# EAGLE design MegaMini (EAGLE 8.3.2)
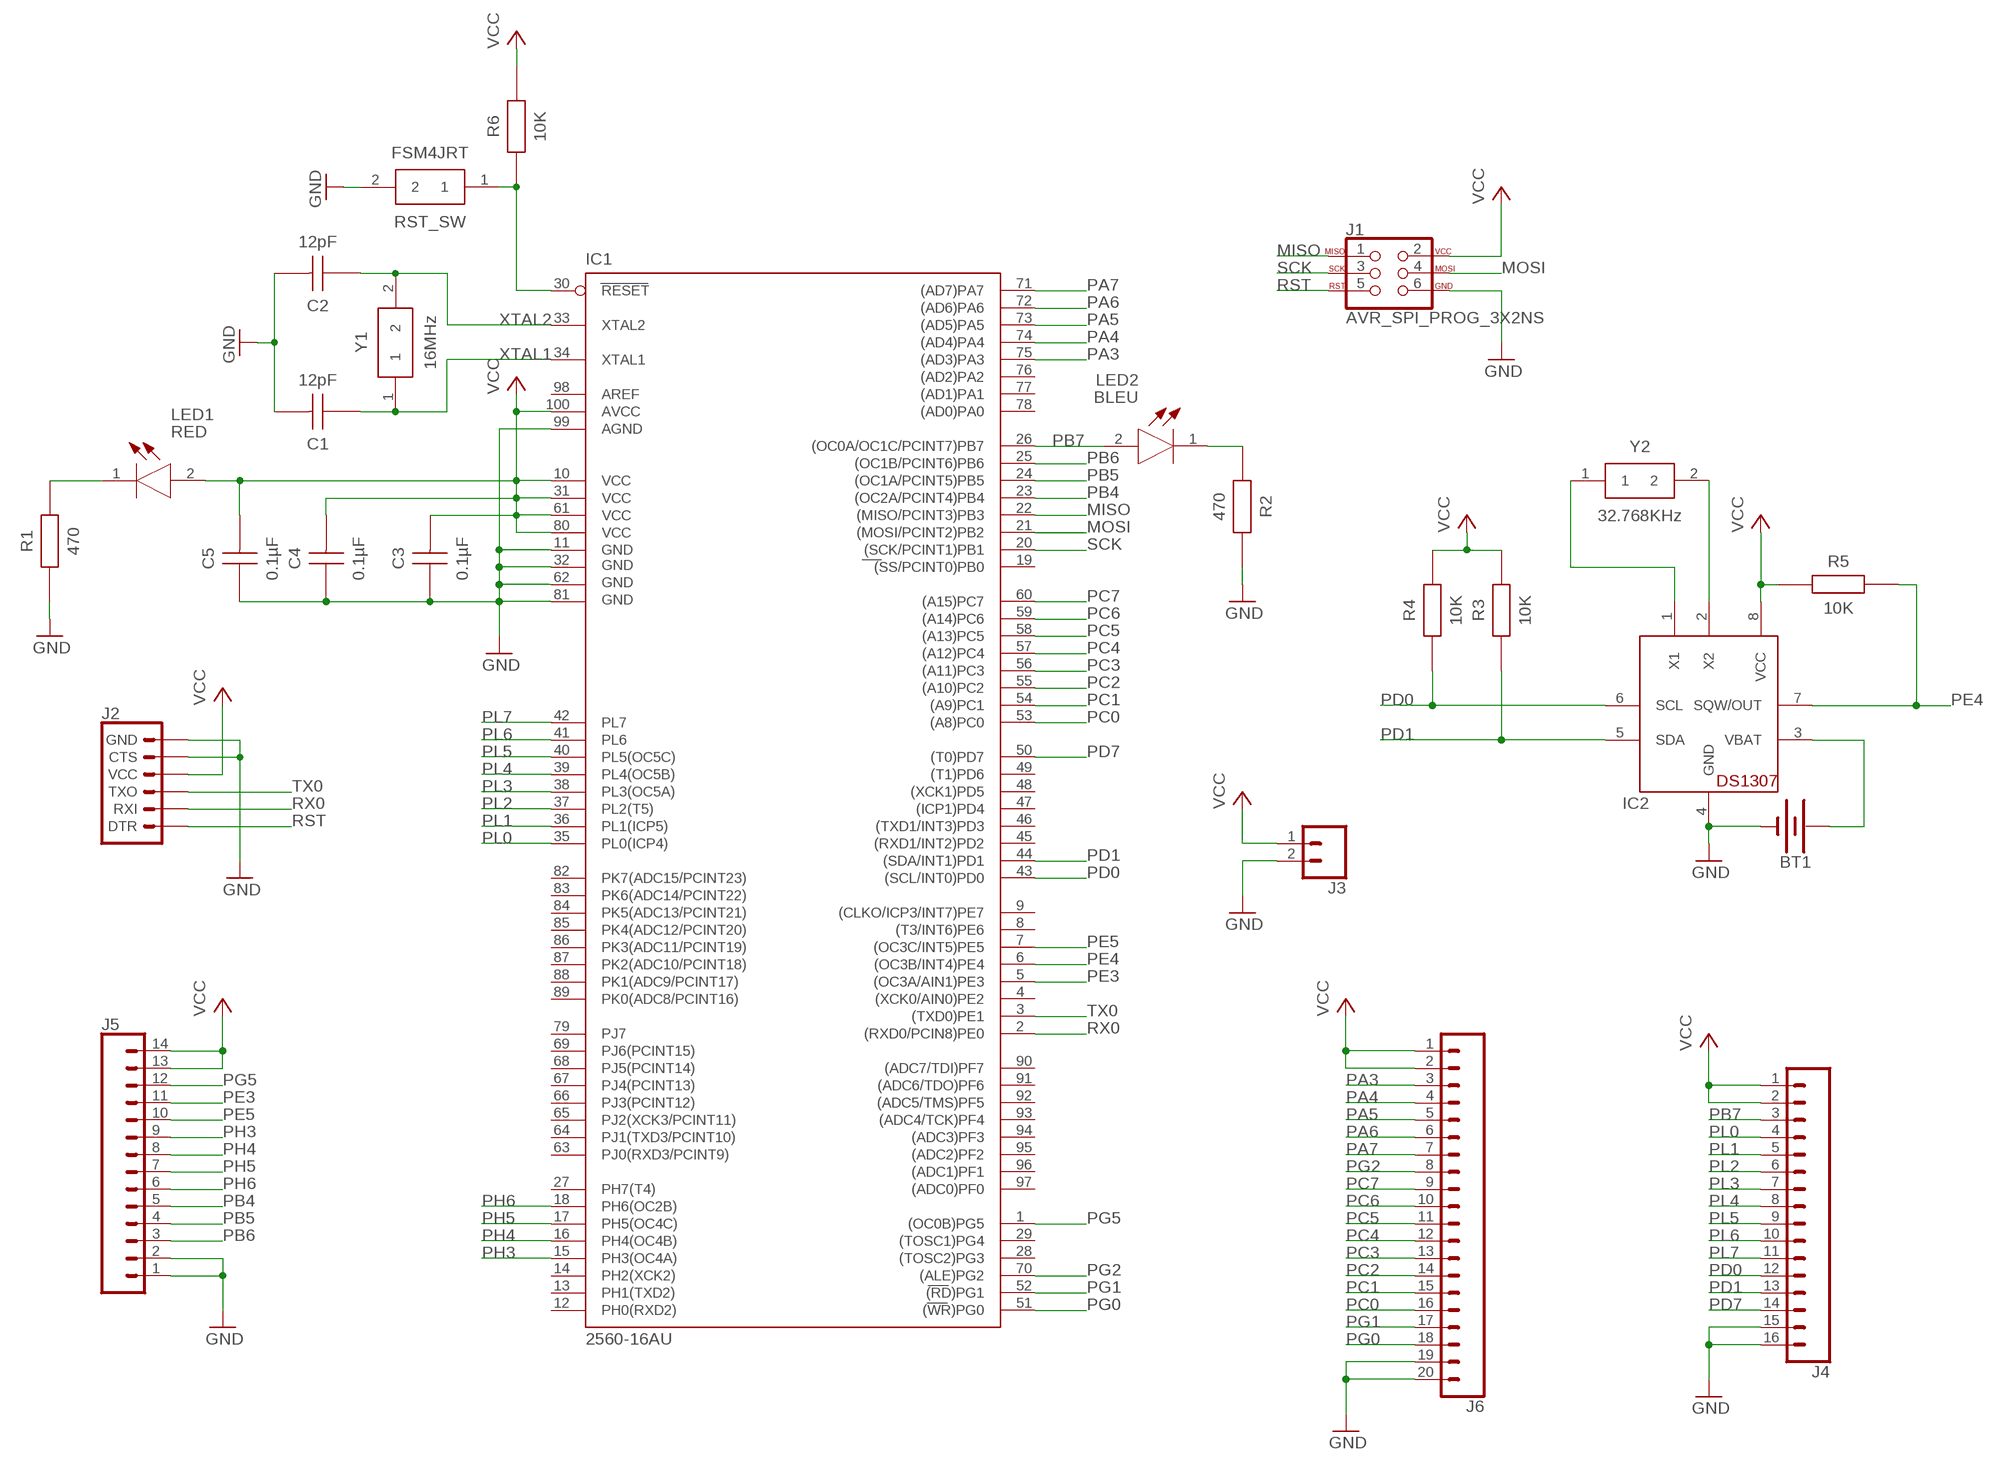
[diagram p0: schematic, sheet 1]

## Parts
BT1  BATTERY-12MM_PTH  [BATTCON_12MM_PTH]
C1  12pF  C1206C120J5GACTU  [CAPC3216X88N]
C2  12pF  C1206C120J5GACTU  [CAPC3216X88N]
C3  0.1µF  C1206C104K5RACTU  [CAPC3216X88N]
C4  0.1µF  C1206C104K5RACTU  [CAPC3216X88N]
C5  0.1µF  C1206C104K5RACTU  [CAPC3216X88N]
IC1  2560-16AU  ATMEGA2560-16AU  [TQFP100]
IC2  DS1307  [DIL08]
J1  AVR_SPI_PROG_3X2NS  [2X3-NS]
J2  6_PIN_SERIAL_TARGET  [1X06]
J3  CONN_02  [1X02]
J4  CONN_16  [1X16]
J5  CONN_14  [1X14]
J6  CONN_20  [1X20]
LED1  RED  150060RS75000  [LEDC1608X80N]
LED2  BLEU  150120BS75000  [LEDC3214X78N]
R1  470  ERJ8ENF4700V  [RESC3116X70N]
R2  470  ERJ8ENF4700V  [RESC3116X70N]
R3  10K  ERJ-8ENF1002V  [RESC3116X70N]
R4  10K  ERJ-8ENF1002V  [RESC3116X70N]
R5  10K  ERJ-8ENF1002V  [RESC3116X70N]
R6  10K  ERJ-8ENF1002V  [RESC3116X70N]
RST_SW  FSM4JRT  [FSM4JRT]
Y1  16MHz  FOXSDLF_160-20  [FOXSDLF/120-20]
Y2  32.768KHz  Q13FC13500004_FC-135_32.768KHZ  [FC-135]

## Nets
GND: BT1.GND(-) C1.2 C2.2 C3.1 C4.1 C5.1 IC1.11(GND) IC1.32(GND1) IC1.62(GND2) IC1.81(GND3) IC1.99(AGND) IC2.4(GND) J1.6 J2.5(CTS) J2.6(GND) J3.2 J4.15 J4.16 J5.1 J5.2 J6.19 J6.20 R1.1 R2.2 RST_SW.2
MISO: IC1.22((MISO/PCINT3)PB3) J1.1
MOSI: IC1.21((MOSI/PCINT2)PB2) J1.4
N$1: IC1.30(RESET) R6.1 RST_SW.1
N$3: IC2.1(X1) Y2.1
N$4: IC2.2(X2) Y2.2
N$12: LED1.1(K) R1.2
N$15: LED2.1(K) R2.1
N$24: BT1.VCC@1(+) IC2.3(VBAT)
PA3: IC1.75((AD3)PA3) J6.3
PA4: IC1.74((AD4)PA4) J6.4
PA5: IC1.73((AD5)PA5) J6.5
PA6: IC1.72((AD6)PA6) J6.6
PA7: IC1.71((AD7)PA7) J6.7
PB4: IC1.23((OC2A/PCINT4)PB4) J5.5
PB5: IC1.24((OC1A/PCINT5)PB5) J5.4
PB6: IC1.25((OC1B/PCINT6)PB6) J5.3
PB7: IC1.26((OC0A/OC1C/PCINT7)PB7) J4.3 LED2.2(A)
PC0: IC1.53((A8)PC0) J6.16
PC1: IC1.54((A9)PC1) J6.15
PC2: IC1.55((A10)PC2) J6.14
PC3: IC1.56((A11)PC3) J6.13
PC4: IC1.57((A12)PC4) J6.12
PC5: IC1.58((A13)PC5) J6.11
PC6: IC1.59((A14)PC6) J6.10
PC7: IC1.60((A15)PC7) J6.9
PD0: IC1.43((SCL/INT0)PD0) IC2.6(SCL) J4.12 R4.1
PD1: IC1.44((SDA/INT1)PD1) IC2.5(SDA) J4.13 R3.1
PD7: IC1.50((T0)PD7) J4.14
PE3: IC1.5((OC3A/AIN1)PE3) J5.11
PE4: IC1.6((OC3B/INT4)PE4) IC2.7(SQW/OUT) R5.2
PE5: IC1.7((OC3C/INT5)PE5) J5.10
PG0: IC1.51((WR)PG0) J6.18
PG1: IC1.52((RD)PG1) J6.17
PG2: IC1.70((ALE)PG2) J6.8
PG5: IC1.1((OC0B)PG5) J5.12
PH3: IC1.15(PH3(OC4A)) J5.9
PH4: IC1.16(PH4(OC4B)) J5.8
PH5: IC1.17(PH5(OC4C)) J5.7
PH6: IC1.18(PH6(OC2B)) J5.6
PL0: IC1.35(PL0(ICP4)) J4.4
PL1: IC1.36(PL1(ICP5)) J4.5
PL2: IC1.37(PL2(T5)) J4.6
PL3: IC1.38(PL3(OC5A)) J4.7
PL4: IC1.39(PL4(OC5B)) J4.8
PL5: IC1.40(PL5(OC5C)) J4.9
PL6: IC1.41(PL6) J4.10
PL7: IC1.42(PL7) J4.11
RST: J1.5 J2.1(DTR)
RX0: IC1.2((RXD0/PCIN8)PE0) J2.2(RXI)
SCK: IC1.20((SCK/PCINT1)PB1) J1.3
TX0: IC1.3((TXD0)PE1) J2.3(TXO)
VCC: C3.2 C4.2 C5.2 IC1.10(VCC) IC1.31(VCC1) IC1.61(VCC2) IC1.80(VCC3) IC1.100(AVCC) IC2.8(VCC) J1.2 J2.4(VCC) J3.1 J4.1 J4.2 J5.13 J5.14 J6.1 J6.2 LED1.2(A) R3.2 R4.2 R5.1 R6.2
XTAL1: C1.1 IC1.34(XTAL1) Y1.1
XTAL2: C2.1 IC1.33(XTAL2) Y1.2
Unconnected: IC1.4((XCK0/AIN0)PE2) IC1.8((T3/INT6)PE6) IC1.9((CLKO/ICP3/INT7)PE7) IC1.12(PH0(RXD2)) IC1.13(PH1(TXD2)) IC1.14(PH2(XCK2)) IC1.19((SS/PCINT0)PB0) IC1.27(PH7(T4)) IC1.28((TOSC2)PG3) IC1.29((TOSC1)PG4) IC1.45((RXD1/INT2)PD2) IC1.46((TXD1/INT3)PD3) IC1.47((ICP1)PD4) IC1.48((XCK1)PD5) IC1.49((T1)PD6) IC1.63(PJ0(RXD3/PCINT9)) IC1.64(PJ1(TXD3/PCINT10)) IC1.65(PJ2(XCK3/PCINT11)) IC1.66(PJ3(PCINT12)) IC1.67(PJ4(PCINT13)) IC1.68(PJ5(PCINT14)) IC1.69(PJ6(PCINT15)) IC1.76((AD2)PA2) IC1.77((AD1)PA1) IC1.78((AD0)PA0) IC1.79(PJ7) IC1.82(PK7(ADC15/PCINT23)) IC1.83(PK6(ADC14/PCINT22)) IC1.84(PK5(ADC13/PCINT21)) IC1.85(PK4(ADC12/PCINT20)) IC1.86(PK3(ADC11/PCINT19)) IC1.87(PK2(ADC10/PCINT18)) IC1.88(PK1(ADC9/PCINT17)) IC1.89(PK0(ADC8/PCINT16)) IC1.90((ADC7/TDI)PF7) IC1.91((ADC6/TDO)PF6) IC1.92((ADC5/TMS)PF5) IC1.93((ADC4/TCK)PF4) IC1.94((ADC3)PF3) IC1.95((ADC2)PF2) IC1.96((ADC1)PF1) IC1.97((ADC0)PF0) IC1.98(AREF)

## Library data of the parts
BT1 = SparkFun-Batteries:BATTERY: Battery - Single Cell A variety of battery chemistries, sizes, and footprints. Device List: 20MM_PTH - Coin Cell Battery Holder - 20mm (PTH) <https://www.sparkfun.com/products/783> 6.8MM_PTH - Coin Cell Battery Holder - 6.8MM(SMD) <https://www.digikey.com/product-detail/en/seiko-instruments/MS621FE-FL11E/728-1057-ND/1889208?WT.srch=1&gclid=CNOQ5a6LzdQCFZS2wAodXCkE0g> 12MM_SMD - Coin Cell Battery Holder - 12mm (SMD) <https://www.sparkfun.com/products/10592> 12MM_PTH - Coin Cell Battery Holder - 12mm (PTH) <https://www.sparkfun.com/products/7948> 20MM_SMD - 20mm Coin Cell Battery Holder (SMD) (2 legs) Used on the Big Time Watch Kit <https://www.sparkfun.com/products/11734> 20MM_SMD_4LEGS - Coin Cell Battery Holder - 20mm (SMD) <https://www.sparkfun.com/products/11892> 20MM_SMD_4LEGS_OVERPASTE - Coin Cell Battery Holder - 20mm (SMD) <https://www.sparkfun.com/products/11892> (Over-paste on the legs) 24.5MM_PTH - Coin Cell Battery Holder - 24.5mm (PTH) <https://www.sparkfun.com/products/8863> 9V - 9V Battery Holder - PC Mount Used on the SparkFun SparkPunk Sound Kit <https://www.sparkfun.com/products/11177> and SparkFun SparkPunk Sequencer Kit <https://www.sparkfun.com/products/12707> 18650 - Battery Holder - 18650 (PTH) <https://www.sparkfun.com/products/13113> AA - Battery Holder - 1xAA (PTH) <https://www.sparkfun.com/products/7949> AAA - Battery Holder - 1xAAA (PTH) <https://www.sparkfun.com/products/12718> AA_KIT - Battery Holder - 1xAA (PTH) <https://www.sparkfun.com/products/7949> Special kit package - pads only have exposed copper on one side of the board. AAA_KIT - Battery Holder - 1xAAA (PTH) <https://www.sparkfun.com/products/12718> Special kit package - pads only have exposed copper on one side of the board.; PROD_ID: BATT-08315; SF_SKU: PRT-07948
C1 C2 = C_C1206C120J5GACTU:C1206C120J5GACTU: Kemet 1206 C 12pF Ceramic Multilayer Capacitor, 50 V, +125C, C0G Dielectric, 5% <https://componentsearchengine.com/Images/3/C1206C120J5GACTU.jpg> Source: Datasheet <http://uk.rs-online.com/webdocs/1526/0900766b81526086.pdf>; DESCRIPTION: Kemet 1206 C 12pF Ceramic Multilayer Capacitor, 50 V, +125C, C0G Dielectric, 5%; HEIGHT: 0.88mm; MANUFACTURER_NAME: Kemet; MANUFACTURER_PART_NUMBER: C1206C120J5GACTU; RS_PART_NUMBER: 8029986P; SUPPLIER_NAME: RS
C3-C5 = C_C1206C104K5RACTU:C1206C104K5RACTU: Multilayer Ceramic Capacitors MLCC - SMD/SMT 50volts 0.1uF X7R 10% <https://componentsearchengine.com/Images/1/C1206C104K5RACTU.jpg> Source: Datasheet <http://docs-europe.electrocomponents.com/webdocs/1380/0900766b81380084.pdf>; DESCRIPTION: Multilayer Ceramic Capacitors MLCC - SMD/SMT 50volts 0.1uF X7R 10%; HEIGHT: 0.88mm; MANUFACTURER_NAME: Kemet; MANUFACTURER_PART_NUMBER: C1206C104K5RACTU; RS_PART_NUMBER: 2644179P; SUPPLIER_NAME: RS
IC1 = atmel-2005:ATMEGA*: MICROCONTROLLER 64/128/256 Kbytes FLASH 4 Kbytes EEPROM 8 Kbytes SRAM 86 General Purpose I/O pins 12-channels16-bit PWM 4 x Serial USARTs 16-channels 10-bit A/D
IC2 = adafruit:DS1307: DS1307 Real time clock (RTC) with battery backup ability. Talk to it via i2c
J1 = SparkFun-Connectors:AVR_SPI_PROG_3X2: AVR ISP 6 Pin This is the reduced ISP connector for AVR programming. Common on Arduino. This footprint will take up less PCB space and can be used with a 10-pin to 6-pin adapter such as SKU: BOB-08508 **Special note about "TEST_POINT" package. The stop mask is on the top side, so if you want your programming test points to be on the bottom of your board, make sure to place this package on the bottom side of the board. This also ensure that the orientation to program from the bottom side will be correct. SparkFun Products: SparkFun ISP Pogo Adapter <https://www.sparkfun.com/products/11591> - NS Tiny AVR Programmer <https://www.sparkfun.com/products/11801> -PTH
J2 = SparkFun-Connectors:6_PIN_SERIAL_TARGET: 6-pin header connection for use with the "FTDI BASIC" pinout - TARGET SIDE. Also known as "Arduino Serial Program Header". It is used to mate with our FTDI Basic serial programmers using the Arduino IDE. Note, this device has "TARGET" in the name. It is intended to be used on a design that contains a target micro-controller that you wish to program. The "sister" device, named "CABLE" is inteneded to be used on a design that usually lives on the end of your USB cable and prvides the converter chip (FTDI232 or FTDI231x) to commnicate serial RX/TX. You can populate with some of these: Break Away Headers - Straight <https://www.sparkfun.com/products/116> (PRT-00116) For reference (or to suit your programming needs) check out these designs: SparkFun FTDI Basic Breakout - 5V <https://www.sparkfun.com/products/9716> (DEV-09716) SparkFun FTDI Basic Breakout - 3.3V <https://www.sparkfun.com/products/9873> (DEV-09873) SparkFun FTDI SmartBasic <https://www.sparkfun.com/products/12935> (DEV-12935) SparkFun Beefy 3 - FTDI Basic Breakout <https://www.sparkfun.com/products/13746> (DEV-13746)
J3 = SparkFun-Connectors:CONN_02: Multi connection point. Often used as Generic Header-pin footprint for 0.1 inch spaced/style header connections On any of the 0.1 inch spaced packages, you can populate with these: Break Away Headers - Straight <https://www.sparkfun.com/products/116> (PRT-00116) Break Away Male Headers - Right Angle <https://www.sparkfun.com/products/553> (PRT-00553) Female Headers <https://www.sparkfun.com/products/115> (PRT-00115) Break Away Headers - Machine Pin <https://www.sparkfun.com/products/117> (PRT-00117) Break Away Female Headers - Swiss Machine Pin <https://www.sparkfun.com/products/743> (PRT-00743) For SCREWTERMINALS and SPRING TERMINALS visit here: Screw Terimnals on SparkFun.com <https://www.sparkfun.com/search/results?term=Screw+Terminals> (5mm/3.5mm/2.54mm spacing) This device is also useful as a general connection point to wire up your design to another part of your project. Our various solder wires solder well into these plated through hole pads. Hook-Up Wire - Assortment (Stranded, 22 AWG) <https://www.sparkfun.com/products/11375> (PRT-11375) Hook-Up Wire - Assortment (Solid Core, 22 AWG) <https://www.sparkfun.com/products/11367> (PRT-11367) View the entire wire category on our website here <https://www.sparkfun.com/categories/141> Special notes: Molex polarized connector foot print use with: PRT-08233 with associated crimp pins and housings. 2.54_SCREWTERM for use with PRT-10571. 3.5mm Screw Terminal footprints for PRT-08084 5mm Screw Terminal footprints for use with PRT-08432
J4 = SparkFun-Connectors:CONN_16: Multi connection point. Often used as Generic Header-pin footprint for 0.1 inch spaced/style header connections On any of the 0.1 inch spaced packages, you can populate with these: Break Away Headers - Straight <https://www.sparkfun.com/products/116> (PRT-00116) Break Away Male Headers - Right Angle <https://www.sparkfun.com/products/553> (PRT-00553) Female Headers <https://www.sparkfun.com/products/115> (PRT-00115) Break Away Headers - Machine Pin <https://www.sparkfun.com/products/117> (PRT-00117) Break Away Female Headers - Swiss Machine Pin <https://www.sparkfun.com/products/743> (PRT-00743) For SCREWTERMINALS and SPRING TERMINALS visit here: Screw Terimnals on SparkFun.com <https://www.sparkfun.com/search/results?term=Screw+Terminals> (5mm/3.5mm/2.54mm spacing) This device is also useful as a general connection point to wire up your design to another part of your project. Our various solder wires solder well into these plated through hole pads. Hook-Up Wire - Assortment (Stranded, 22 AWG) <https://www.sparkfun.com/products/11375> (PRT-11375) Hook-Up Wire - Assortment (Solid Core, 22 AWG) <https://www.sparkfun.com/products/11367> (PRT-11367) View the entire wire category on our website here <https://www.sparkfun.com/categories/141> Special notes: Molex polarized connector foot print use with SKU : PRT-08231 with associated crimp pins and housings. 1MM SMD Version SKU: PRT-10208 NOTES ON THE VARIANTS LOCK and LOCK_LONGPADS... This footprint was designed to help hold the alignment of a through-hole component (i.e. 6-pin header) while soldering it into place. You may notice that each hole has been shifted either up or down by 0.005 of an inch from it's more standard position (which is a perfectly straight line). This slight alteration caused the pins (the squares in the middle) to touch the edges of the holes. Because they are alternating, it causes a "brace" to hold the component in place. 0.005 has proven to be the perfect amount of "off-center" position when using our standard breakaway headers. Although looks a little odd when you look at the bare footprint, once you have a header in there, the alteration is very hard to notice. Also,if you push a header all the way into place, it is covered up entirely on the bottom side.
J5 = SparkFun-Connectors:CONN_14: Multi connection point. Often used as Generic Header-pin footprint for 0.1 inch spaced/style header connections On any of the 0.1 inch spaced packages, you can populate with these: Break Away Headers - Straight <https://www.sparkfun.com/products/116> (PRT-00116) Break Away Male Headers - Right Angle <https://www.sparkfun.com/products/553> (PRT-00553) Female Headers <https://www.sparkfun.com/products/115> (PRT-00115) Break Away Headers - Machine Pin <https://www.sparkfun.com/products/117> (PRT-00117) Break Away Female Headers - Swiss Machine Pin <https://www.sparkfun.com/products/743> (PRT-00743) For SCREWTERMINALS and SPRING TERMINALS visit here: Screw Terimnals on SparkFun.com <https://www.sparkfun.com/search/results?term=Screw+Terminals> (5mm/3.5mm/2.54mm spacing) This device is also useful as a general connection point to wire up your design to another part of your project. Our various solder wires solder well into these plated through hole pads. Hook-Up Wire - Assortment (Stranded, 22 AWG) <https://www.sparkfun.com/products/11375> (PRT-11375) Hook-Up Wire - Assortment (Solid Core, 22 AWG) <https://www.sparkfun.com/products/11367> (PRT-11367) View the entire wire category on our website here <https://www.sparkfun.com/categories/141> Special notes: Molex polarized connector foot print use with SKU : PRT-08231 with associated crimp pins and housings. 1MM SMD Version SKU: PRT-10208 NOTES ON THE VARIANTS LOCK and LOCK_LONGPADS... This footprint was designed to help hold the alignment of a through-hole component (i.e. 6-pin header) while soldering it into place. You may notice that each hole has been shifted either up or down by 0.005 of an inch from it's more standard position (which is a perfectly straight line). This slight alteration caused the pins (the squares in the middle) to touch the edges of the holes. Because they are alternating, it causes a "brace" to hold the component in place. 0.005 has proven to be the perfect amount of "off-center" position when using our standard breakaway headers. Although looks a little odd when you look at the bare footprint, once you have a header in there, the alteration is very hard to notice. Also,if you push a header all the way into place, it is covered up entirely on the bottom side.
J6 = SparkFun-Connectors:CONN_20: Multi connection point. Often used as Generic Header-pin footprint for 0.1 inch spaced/style header connections On any of the 0.1 inch spaced packages, you can populate with these: Break Away Headers - Straight <https://www.sparkfun.com/products/116> (PRT-00116) Break Away Male Headers - Right Angle <https://www.sparkfun.com/products/553> (PRT-00553) Female Headers <https://www.sparkfun.com/products/115> (PRT-00115) Break Away Headers - Machine Pin <https://www.sparkfun.com/products/117> (PRT-00117) Break Away Female Headers - Swiss Machine Pin <https://www.sparkfun.com/products/743> (PRT-00743) For SCREWTERMINALS and SPRING TERMINALS visit here: Screw Terimnals on SparkFun.com <https://www.sparkfun.com/search/results?term=Screw+Terminals> (5mm/3.5mm/2.54mm spacing) This device is also useful as a general connection point to wire up your design to another part of your project. Our various solder wires solder well into these plated through hole pads. Hook-Up Wire - Assortment (Stranded, 22 AWG) <https://www.sparkfun.com/products/11375> (PRT-11375) Hook-Up Wire - Assortment (Solid Core, 22 AWG) <https://www.sparkfun.com/products/11367> (PRT-11367) View the entire wire category on our website here <https://www.sparkfun.com/categories/141> Special notes: Molex polarized connector foot print use with SKU : PRT-08231 with associated crimp pins and housings. 1MM SMD Version SKU: PRT-10208 NOTES ON THE VARIANTS LOCK and LOCK_LONGPADS... This footprint was designed to help hold the alignment of a through-hole component (i.e. 6-pin header) while soldering it into place. You may notice that each hole has been shifted either up or down by 0.005 of an inch from it's more standard position (which is a perfectly straight line). This slight alteration caused the pins (the squares in the middle) to touch the edges of the holes. Because they are alternating, it causes a "brace" to hold the component in place. 0.005 has proven to be the perfect amount of "off-center" position when using our standard breakaway headers. Although looks a little odd when you look at the bare footprint, once you have a header in there, the alteration is very hard to notice. Also,if you push a header all the way into place, it is covered up entirely on the bottom side. Note about LOCK SPECIAL package: This is just like the LOCK variant in that the holes are staggared by 5 mil, but except for the last two holes. They are not altered from the "standard" footprint layout. This is used for a special purpose on the layout of our Graphic LCD Backpack. Make sure you want to use this device before selecting it for you project!
LED1 = C_150060RS75000:150060RS75000: WURTH ELEKTRONIK - 150060RS75000 - LED, 0603, RED, 250MCD, 625NM <https://componentsearchengine.com/Images/1/150060RS75000.JPG> Source: Datasheet <http://katalog.we-online.de/led/datasheet/150060RS75000.pdf>; DESCRIPTION: WURTH ELEKTRONIK - 150060RS75000 - LED, 0603, RED, 250MCD, 625NM; HEIGHT: 0.8mm; MANUFACTURER_NAME: W&uuml;rth Elektronik; MANUFACTURER_PART_NUMBER: 150060RS75000; SUPPLIER_NAME: RS
LED2 = C_150120BS75000:150120BS75000: LED,Wurth Elektronik,150120BS75000 Wurth Elektronik 150120BS75000, WL-SMCW Series Blue LED, 470 nm, 3016 (1206) Clear, Rectangle Lens SMD Package <https://componentsearchengine.com/Images/3/150120BS75000.jpg> Source: Datasheet <http://docs-europe.electrocomponents.com/webdocs/1302/0900766b81302e27.pdf>; DESCRIPTION: LED,Wurth Elektronik,150120BS75000 Wurth Elektronik 150120BS75000, WL-SMCW Series Blue LED, 470 nm, 3016 (1206) Clear, Rectangle Lens SMD Package; HEIGHT: 0.78mm; MANUFACTURER_NAME: W&uuml;rth Elektronik; MANUFACTURER_PART_NUMBER: 150120BS75000; RS_PART_NUMBER: 8154243; SUPPLIER_NAME: RS
R1 R2 = C_ERJ8ENF4700V:ERJ8ENF4700V: PANASONIC ELECTRONIC COMPONENTS - ERJ8ENF4700V - RES, THICK FILM, 470R, 1%, 0.25W, 1206 <https://componentsearchengine.com/Images/3/ERJ8ENF4700V.jpg> Source: Datasheet <http://docs-europe.electrocomponents.com/webdocs/13ba/0900766b813ba21b.pdf>; DESCRIPTION: PANASONIC ELECTRONIC COMPONENTS - ERJ8ENF4700V - RES, THICK FILM, 470R, 1%, 0.25W, 1206; HEIGHT: 0.7mm; MANUFACTURER_NAME: Panasonic; MANUFACTURER_PART_NUMBER: ERJ8ENF4700V; RS_PART_NUMBER: 1142909; SUPPLIER_NAME: RS
R3-R6 = C_ERJ8ENF1002V:ERJ-8ENF1002V: Thick Film Resistors - SMD 1206 10Kohms 1% Tol <https://componentsearchengine.com/Images/1/ERJ-8ENF1002V.jpg> Source: Datasheet <https://industrial.panasonic.com/cdbs/www-data/pdf/RDA0000/AOA0000C86.pdf>; DESCRIPTION: Thick Film Resistors - SMD 1206 10Kohms 1% Tol; HEIGHT: 0.7mm; MANUFACTURER_NAME: Panasonic; MANUFACTURER_PART_NUMBER: ERJ-8ENF1002V; SUPPLIER_NAME: RS
RST_SW = C_FSM4JRT:FSM4JRT: Tactile switch,PCB,SPST,raised actuator Black Button Tactile Switch, SPST 50 mA@ 24 V dc 1.4mm <https://componentsearchengine.com/Images/3/FSM4JRT.jpg> Source: Datasheet <http://www.mouser.com/ds/2/418/NG_CD_2-1437565-2_P5-663780.pdf>; DESCRIPTION: Tactile switch,PCB,SPST,raised actuator Black Button Tactile Switch, SPST 50 mA@ 24 V dc 1.4mm; HEIGHT: mm; MANUFACTURER_NAME: TE Connectivity; MANUFACTURER_PART_NUMBER: FSM4JRT; RS_PART_NUMBER: 7182415P; SUPPLIER_NAME: RS
Y1 = C_FOXSDLF_160-20:FOXSDLF_160-20: Crystal SMD 16.000MHz HC49S-SMD Crystal 16MHz, 30ppm, 2-Pin SMD, 11.7 x 5 x 4.5mm <https://componentsearchengine.com/Images/3/FOXSDLF_160-20.jpg> Source: Datasheet <http://www.mouser.com/ds/2/160/C4SD-1131563.pdf>; DESCRIPTION: Crystal SMD 16.000MHz HC49S-SMD Crystal 16MHz, 30ppm, 2-Pin SMD, 11.7 x 5 x 4.5mm; HEIGHT: mm; MANUFACTURER_NAME: FOX ELECTRONICS; MANUFACTURER_PART_NUMBER: FOXSDLF/160-20; RS_PART_NUMBER: 5476531; SUPPLIER_NAME: RS
Y2 = C_Q13FC13500004_FC-135_32.768KHZ:Q13FC13500004_FC-135_32.768KHZ: kHz Range Crystal Unit Source: Datasheet <https://support.epson.biz/td/api/doc_check.php?mode=dl&lang=en&Parts=FC-135.pdf>; DESCRIPTION: kHz Range Crystal Unit; HEIGHT: mm; MANUFACTURER_NAME: EPSON; MANUFACTURER_PART_NUMBER: Q13FC13500004 FC-135 32.768KHZ 12.5PF; SUPPLIER_NAME: RS

## Board
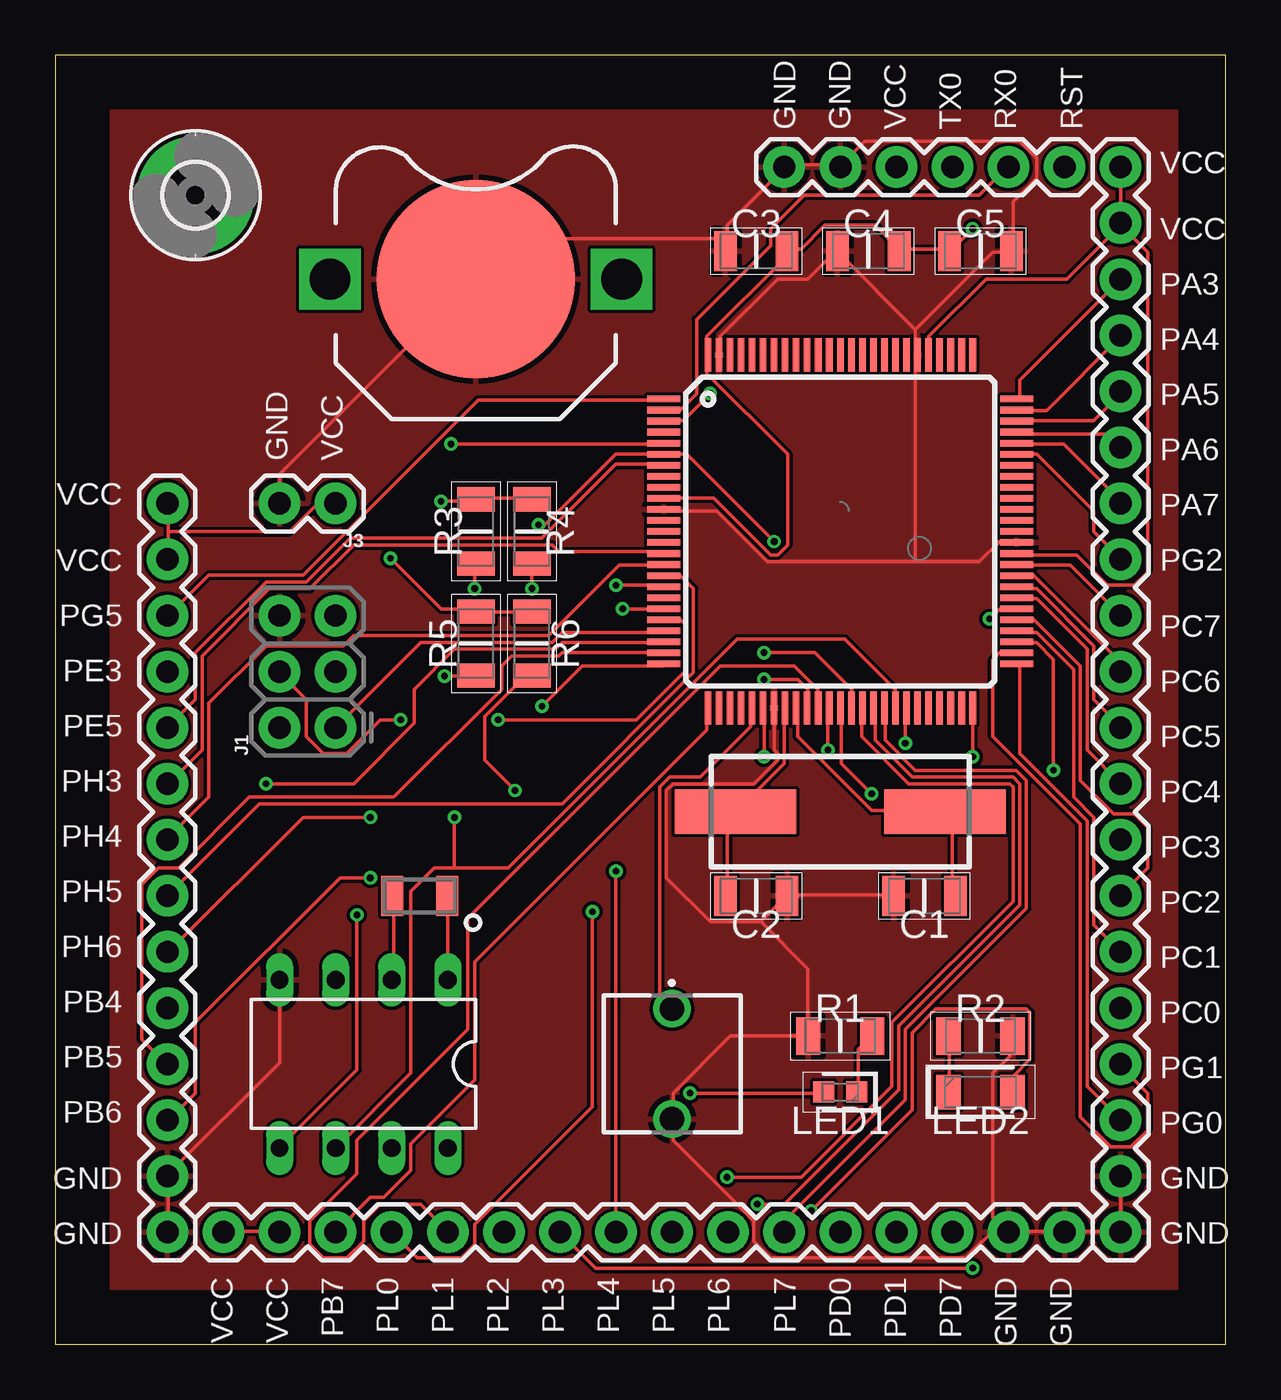
[diagram p1: board, top side]
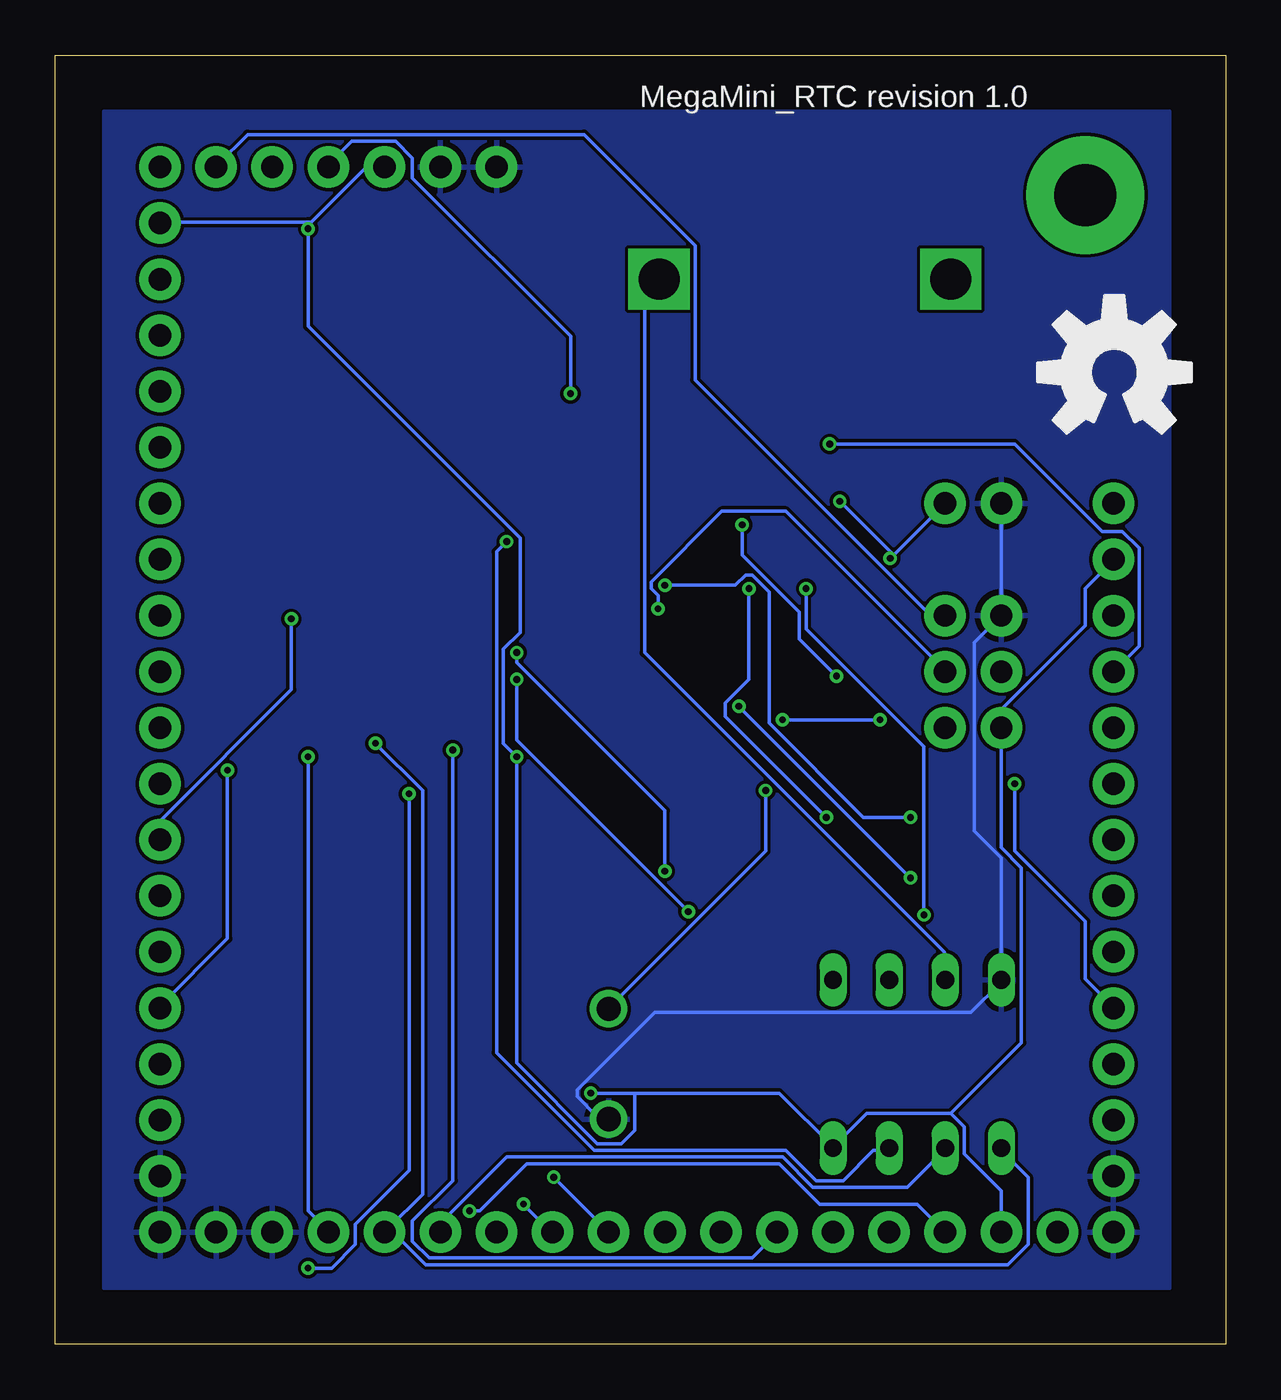
[diagram p2: board, bottom side, seen from below]

Size 53.01 x 58.41 mm. Coordinates in mm from the lower left corner, seen from the top.
Outline: 0,0 53.01,0 53.01,58.41 0,58.41 0,0
Copper layers (1*16): Top 0.035mm / dielectric 1.6mm / Bottom 0.035mm
Design rules "Elecrow_2-layer_PCB_eagle_rule": minimum track width 6mil, minimum drill 12mil, track to track 6mil, track to pad 6mil, pad to pad 6mil, via to via 8mil, smd to smd 0mil, copper to edge 20mil, drill to drill 10mil, minimum pad ring 6mil, minimum via ring 6mil, stop-mask expansion 0mil, vias tented up to drill 100mil, thermal gap 10mil

### Footprints (pad centres in the part's own frame; a part is rotated, then mirrored left to right if it is on the bottom)
BATTCON_12MM_PTH = smd 9 x 9: GND 0,0 | drill 1.854 square: VCC@1 6.604,0; VCC@2 -6.604,0
CAPC3216X88N = smd 1.02 x 1.82: 1 -1.4,0; 2 1.4,0
2,8-PAD = drill 2.8 pad 5.334: B2,8 0,0
TQFP100 = smd 1.5 x 0.299: 1 -8,6; 2 -8,5.5; 3 -8,5; 4 -8,4.5; 5 -8,4; 6 -8,3.5; 7 -8,3; 8 -8,2.5; 9 -8,2; 10 -8,1.5; 11 -8,1; 12 -8,0.5; 13 -8,0; 14 -8,-0.5; 15 -8,-1; 16 -8,-1.5; 17 -8,-2; 18 -8,-2.5; 19 -8,-3; 20 -8,-3.5; 21 -8,-4; 22 -8,-4.5; 23 -8,-5; 24 -8,-5.5; 25 -8,-6; 51 8,-6; 52 8,-5.5; 53 8,-5; 54 8,-4.5; 55 8,-4; 56 8,-3.5; 57 8,-3; 58 8,-2.5; 59 8,-2; 60 8,-1.5; 61 8,-1; 62 8,-0.5; 63 8,0; 64 8,0.5; 65 8,1; 66 8,1.5; 67 8,2; 68 8,2.5; 69 8,3; 70 8,3.5; 71 8,4; 72 8,4.5; 73 8,5; 74 8,5.5; 75 8,6 | smd 0.299 x 1.5: 26 -6,-8; 27 -5.5,-8; 28 -5,-8; 29 -4.5,-8; 30 -4,-8; 31 -3.5,-8; 32 -3,-8; 33 -2.5,-8; 34 -2,-8; 35 -1.5,-8; 36 -1,-8; 37 -0.5,-8; 38 0,-8; 39 0.5,-8; 40 1,-8; 41 1.5,-8; 42 2,-8; 43 2.5,-8; 44 3,-8; 45 3.5,-8; 46 4,-8; 47 4.5,-8; 48 5,-8; 49 5.5,-8; 50 6,-8; 76 6,8; 77 5.5,8; 78 5,8; 79 4.5,8; 80 4,8; 81 3.5,8; 82 3,8; 83 2.5,8; 84 2,8; 85 1.5,8; 86 1,8; 87 0.5,8; 88 0,8; 89 -0.5,8; 90 -1,8; 91 -1.5,8; 92 -2,8; 93 -2.5,8; 94 -3,8; 95 -3.5,8; 96 -4,8; 97 -4.5,8; 98 -5,8; 99 -5.5,8; 100 -6,8
DIL08 = drill 0.813 long: 1 -3.81,-3.81; 2 -1.27,-3.81; 3 1.27,-3.81; 4 3.81,-3.81; 5 3.81,3.81; 6 1.27,3.81; 7 -1.27,3.81; 8 -3.81,3.81
2X3-NS = drill 1.016 pad 1.88: 1 -2.54,-1.27; 2 -2.54,1.27; 3 0,-1.27; 4 0,1.27; 5 2.54,-1.27; 6 2.54,1.27
1X06 = drill 1.016 pad 1.88: 1 0,0; 2 2.54,0; 3 5.08,0; 4 7.62,0; 5 10.16,0; 6 12.7,0
1X02 = drill 1.016 pad 1.88: 1 0,0; 2 2.54,0
1X16 = drill 1.016 pad 1.88: 1 0,0; 2 2.54,0; 3 5.08,0; 4 7.62,0; 5 10.16,0; 6 12.7,0; 7 15.24,0; 8 17.78,0; 9 20.32,0; 10 22.86,0; 11 25.4,0; 12 27.94,0; 13 30.48,0; 14 33.02,0; 15 35.56,0; 16 38.1,0
1X14 = drill 1.016 pad 1.88: 1 0,0; 2 2.54,0; 3 5.08,0; 4 7.62,0; 5 10.16,0; 6 12.7,0; 7 15.24,0; 8 17.78,0; 9 20.32,0; 10 22.86,0; 11 25.4,0; 12 27.94,0; 13 30.48,0; 14 33.02,0
1X20 = drill 1.016 pad 1.88: 1 0,0; 2 2.54,0; 3 5.08,0; 4 7.62,0; 5 10.16,0; 6 12.7,0; 7 15.24,0; 8 17.78,0; 9 20.32,0; 10 22.86,0; 11 25.4,0; 12 27.94,0; 13 30.48,0; 14 33.02,0; 15 35.56,0; 16 38.1,0; 17 40.64,0; 18 43.18,0; 19 45.72,0; 20 48.26,0
LEDC1608X80N = smd 0.95 x 0.95: 1 -0.75,0; 2 0.75,0
LEDC3214X78N = smd 1.1 x 1.55: 1 -1.45,0; 2 1.45,0
RESC3116X70N = smd 1.1 x 1.7: 1 -1.45,0; 2 1.45,0
FSM4JRT = drill 1.1 pad 1.7: 1 0,2.5; 2 0,-2.5
FOXSDLF/120-20 = smd 5.5 x 2: 1 -4.75,0; 2 4.75,0
FC-135 = smd 1 x 1.8: 1 -1.25,0; 2 1.25,0

### Placement (x,y rotation side)
BT1  19.05,48.26 0 top
C1  39.37,20.32 180 top
C2  31.75,20.32 0 top
C3  31.75,49.53 0 top
C4  36.83,49.53 0 top
C5  41.91,49.53 180 top
H1  MOUNT-PAD-ROUND2.8  [2,8-PAD]  6.35,52.07 0 top
IC1  35.56,36.83 0 top
IC2  13.97,12.7 180 top
J1  11.43,30.48 90 top
J2  45.72,53.34 180 top
J3  12.7,38.1 180 top
J4  7.62,5.08 0 top
J5  5.08,5.08 90 top
J6  48.26,53.34 270 top
LED1  35.56,11.43 180 top
LED2  41.91,11.43 0 top
R1  35.56,13.97 0 top
R2  41.91,13.97 0 top
R3  19.05,36.83 90 top
R4  21.59,36.83 90 top
R5  19.05,31.75 270 top
R6  21.59,31.75 90 top
RST_SW  27.94,12.7 0 top
U$1  [OSHW-LOGO-L]  5.04,44.04 0 bottom
Y1  35.56,24.13 180 top
Y2  16.51,20.32 180 top

### Tracks (layer width: path | path; a pad name or v marks a point on that pad's centre or on a via)
GND
  Top 0.152: 48.26,5.13 45.82,5.13 J4.16 45.67,5.13 43.23,5.13 J4.15 | 48.26,5.13 J6.19 | 48.26,5.13 J6.20 | 42.77,5.44 43.08,5.13 J4.15 | 42.77,5.44 42.47,5.74 42.47,12.29 43.23,13.06 43.23,13.97 R2.2 | 31.95,19.15 29.67,19.15 27.69,21.13 27.69,25.09 27.99,25.4 31.65,25.4 32.71,26.47 32.71,26.77 32.56,26.92 32.56,28.75 IC1.32 | 31.95,19.15 33.02,20.22 C2.2 33.17,20.37 37.9,20.37 C1.2 | 34.09,13.97 34.09,17.02 31.95,19.15 | 34.09,13.97 30.58,13.97 27.99,11.38 27.99,10.31 RST_SW.2 27.99,10.16 27.99,9.25 31.65,5.59 31.65,4.67 32.41,3.91 41.25,3.91 42.77,5.44 | 34.09,13.97 R1.1 | 42.77,5.44 J4.15 | 38.96,35.46 41.86,35.46 42.77,36.37 43.54,36.37 IC1.62 | 38.96,35.46 32.26,35.46 29.97,37.74 27.69,37.74 IC1.11 | IC1.99 30.12,44.91 30.12,45.67 32.71,48.26 34.09,48.26 35.31,49.48 C4.1 35.46,49.48 38.96,45.97 | 38.96,45.97 38.96,44.91 IC1.81 38.96,44.76 38.96,35.46 | 38.96,45.97 42.47,49.48 43.23,49.48 C5.1 43.38,49.63 43.38,51.77 44.45,52.83 44.45,53.75 43.69,54.51 36.68,54.51 35.61,53.44 J2.5 35.46,53.44 33.02,53.44 J2.6 33.02,53.29 30.43,50.7 30.43,50.09 | IC2.4 10.16,12.75 5.13,7.72 J5.2 5.13,7.57 5.13,5.13 J5.1 | 30.43,50.09 30.43,49.63 C3.1 30.43,50.09 | J3.2 10.16,39.42 19,48.26 BT1.GND 19.15,48.26 20.98,50.09 30.43,50.09
  Bottom 0.152: J3.2 J1.6 11.38,31.8 11.38,23.27 10.16,22.05 IC2.4 10.16,16.41 11.53,15.04 25.86,15.04 29.36,11.53 29.36,11.23 28.45,10.31 27.99,10.31 RST_SW.2
  pour Top: 2.54,55.88 50.8,55.88 50.8,2.54 2.54,2.54
  pour Bottom: 2.54,55.88 50.8,55.88 50.8,2.54 2.54,2.54
MISO
  Top 0.152: J1.1 16.56,31.8 22.5,31.8 22.96,32.26 27.53,32.26 IC1.22
MOSI  (via drill 0.3)
  Top 0.152: v20.07,28.3 26.31,28.3 28.6,30.58 28.6,32.56 28.3,32.87 27.69,32.87 IC1.21 | v15.65,28.3 14.73,28.3 13.21,26.77 12.14,26.77 11.38,27.53 11.38,29.21 10.16,30.43 J1.4
  Bottom 0.152: v15.65,28.3 v20.07,28.3
N$1  (via drill 0.3)
  Top 0.152: IC1.30 31.5,28.75 31.5,27.99 29.21,25.7 27.84,25.7 27.38,25.25 27.38,15.8 27.84,15.34 RST_SW.1 | v20.83,25.09 19.46,26.47 19.46,28.45 21.29,30.28 21.59,30.28 R6.1
  Bottom 0.152: v20.83,25.09 20.83,22.35 27.84,15.34 RST_SW.1
N$3
  Top 0.152: IC2.1 17.78,20.22 Y2.1
N$4
  Top 0.152: Y2.2 15.34,20.22 15.34,16.56 IC2.2
N$12
  Top 0.152: LED1.1 36.37,11.53 36.37,13.36 36.98,13.97 R1.2
N$15
  Top 0.152: LED2.1 40.49,11.53 40.49,13.97 R2.1
N$24
  Bottom 0.152: IC2.3 12.75,16.56 12.75,17.78 26.31,31.34 26.31,47.65 25.7,48.26 BT1.VCC@1
PA3
  Top 0.152: J6.3 43.69,43.69 43.69,42.93 IC1.75
PA4
  Top 0.152: IC1.74 43.69,42.32 44.91,42.32 48.26,45.67 J6.4
PA5
  Top 0.152: IC1.73 43.69,41.86 47.04,41.86 48.26,43.08 J6.5
PA6
  Top 0.152: J6.6 47.65,41.25 43.69,41.25 IC1.72
PA7
  Top 0.152: IC1.71 43.69,40.79 45.67,40.79 48.26,38.2 J6.7
PB4  (via drill 0.3)
  Top 0.152: v9.55,25.4 13.51,25.4 16.26,28.14 16.26,29.67 18.09,31.5 22.66,31.5 22.96,31.8 27.53,31.8 IC1.23
  Bottom 0.152: v9.55,25.4 9.55,22.35 6.35,19.15 6.35,16.56 5.13,15.34 J5.5
PB5
  Top 0.152: IC1.24 27.53,31.34 22.96,31.34 22.81,31.19 20.68,31.19 20.22,30.73 20.22,29.67 15.34,24.79 8.79,24.79 5.59,21.59 4.67,21.59 3.91,20.83 3.91,13.82 4.98,12.75 J5.4
PB6  (via drill 0.3)
  Top 0.152: v22.05,28.9 23.88,30.73 27.53,30.73 IC1.25 | v14.27,21.13 12.9,21.13 6.35,14.58 6.35,11.38 5.13,10.16 J5.3
  Bottom 0.152: v14.27,21.13 v22.05,28.9
PB7  (via drill 0.3)
  Top 0.152: J4.3 14.27,6.66 14.88,6.66 16.1,7.87 16.1,9.09 19,11.99 19,17.32 29.52,27.84 29.52,28.75 IC1.26 | v34.24,6.04 38.81,10.62 38.81,14.12 39.88,15.19 43.99,15.19 44.14,15.04 44.14,12.9 43.38,12.14 43.38,11.53 LED2.2
  Bottom 0.152: v34.24,6.04 33.78,6.04 31.65,8.18 20.22,8.18 18.39,6.35 13.97,6.35 J4.3
PC0  (via drill 0.3)
  Top 0.152: v45.21,26.01 45.21,31.04 44.45,31.8 43.69,31.8 IC1.53
  Bottom 0.152: v45.21,26.01 45.21,18.39 48.26,15.34 J6.16
PC1
  Top 0.152: J6.15 47.04,19 47.04,23.88 46.13,24.79 46.13,30.58 44.45,32.26 43.69,32.26 IC1.54
PC2
  Top 0.152: IC1.55 43.69,32.87 44.3,32.87 46.43,30.73 46.43,25.55 47.95,24.03 48.87,24.03 49.48,23.42 49.48,21.59 48.26,20.37 J6.14
PC3  (via drill 0.3)
  Top 0.152: v42.32,32.87 42.77,33.32 43.54,33.32 IC1.56
  Bottom 0.152: v42.32,32.87 42.32,29.67 48.26,23.72 J6.13
PC4
  Top 0.152: J6.12 46.74,26.92 46.74,31.5 44.45,33.78 43.69,33.78 IC1.57
PC5
  Top 0.152: IC1.58 43.69,34.24 44.45,34.24 47.04,31.65 47.04,29.21 48.26,27.99 J6.11
PC6
  Top 0.152: J6.10 48.26,30.89 44.3,34.85 43.69,34.85 IC1.59
PC7
  Top 0.152: J6.9 45.97,35.31 43.69,35.31 IC1.60
PD0  (via drill 0.3)
  Top 0.152: 18.09,21.59 17.17,21.59 16.1,20.52 16.1,12.29 IC2.6 | 18.09,21.59 20.52,21.59 30.89,31.95 35.76,31.95 38.05,29.67 38.05,28.9 IC1.43 | v21.59,34.24 R4.1 | 18.09,21.59 v18.09,23.88
  Bottom 0.152: v21.59,34.24 21.59,30.12 22.66,29.06 22.66,28.45 v18.09,23.88 | J4.12 35.46,5.13 35.46,5.59 32.56,8.48 20.07,8.48 18.69,7.11 14.43,7.11 12.75,8.79 IC2.6
PD1  (via drill 0.3)
  Top 0.152: v38.51,27.23 38.51,28.75 IC1.44 | v19,34.24 19,35.31 R3.1 | v13.66,19.46 13.66,12.45 10.16,8.94 IC2.5
  Bottom 0.152: v38.51,27.23 36.37,25.09 36.37,6.81 37.9,5.28 | 37.9,5.28 J4.13 38.05,5.13 | v19,34.24 19,32.41 13.66,27.08 v13.66,19.46 | 37.9,5.28 36.22,3.61 9.85,3.61 8.94,4.52 8.94,7.57 10.16,8.79 IC2.5
PD7  (via drill 0.3)
  Top 0.152: v41.55,26.62 41.55,28.75 IC1.50
  Bottom 0.152: v41.55,26.62 41.55,6.04 40.64,5.13 J4.14
PE3  (via drill 0.3)
  Top 0.152: v17.93,40.79 27.53,40.79 IC1.5
  Bottom 0.152: v17.93,40.79 9.55,40.79 5.59,36.83 4.67,36.83 3.91,36.07 3.91,31.65 J5.11
PE4  (via drill 0.3)
  Top 0.152: v21.89,37.13 22.2,37.13 25.4,40.34 27.53,40.34 IC1.6 27.69,40.34 28.6,40.34 v32.56,36.37 | v17.63,30.28 19,30.28 R5.2
  Bottom 0.152: v21.89,37.13 21.89,35.76 19.3,33.17 19.3,31.95 v17.63,30.28 | v32.56,36.37 33.02,35.92 33.02,13.21 28.6,8.79 19.91,8.79 18.54,7.42 17.32,7.42 15.95,8.79 15.34,8.79 IC2.7
PE5
  Top 0.152: J5.10 6.35,29.21 6.35,31.34 9.55,34.54 11.38,34.54 13.36,36.52 22.05,36.52 25.4,39.88 27.53,39.88 IC1.7
PG0
  Top 0.152: J6.18 46.74,11.68 46.74,23.72 43.69,26.77 43.69,30.73 IC1.51
PG1
  Top 0.152: IC1.52 43.54,31.34 42.77,31.34 42.47,31.04 42.47,27.53 46.43,23.57 46.43,10.31 47.8,8.94 48.72,8.94 49.48,9.7 49.48,11.38 48.26,12.6 J6.17
PG2
  Top 0.152: IC1.70 43.69,40.34 44.45,40.34 47.04,37.74 47.04,36.83 48.26,35.61 J6.8
PG5
  Top 0.152: IC1.1 27.53,42.77 19.15,42.77 11.23,34.85 6.96,34.85 5.13,33.02 J5.12
PH3
  Top 0.152: IC1.15 27.53,35.92 22.81,35.92 22.5,36.22 13.51,36.22 11.53,34.24 9.7,34.24 6.66,31.19 6.66,26.92 5.13,25.4 J5.9
PH4
  Top 0.152: IC1.16 27.53,35.31 25.55,35.31 22.35,32.11 13.51,32.11 13.06,31.65 9.55,31.65 6.96,29.06 6.96,24.79 5.13,22.96 J5.8
PH5
  Top 0.152: J5.7 9.25,24.49 22.96,24.49 28.9,30.43 28.9,34.24 28.3,34.85 27.69,34.85 IC1.17
PH6  (via drill 0.3)
  Top 0.152: v25.4,34.39 27.53,34.39 IC1.18 | v14.27,23.88 11.23,23.88 5.13,17.78 J5.6
  Bottom 0.152: v25.4,34.39 22.2,34.39 21.74,34.85 21.44,34.85 20.68,34.09 20.68,28.14 16.41,23.88 v14.27,23.88
PL0  (via drill 0.3)
  Top 0.152: v32.11,30.12 33.63,30.12 34.09,29.67 34.09,28.9 IC1.35 | v24.33,19.61 24.33,10.77 19,5.44 19,4.52 18.39,3.91 16.41,3.91 J4.4
  Bottom 0.152: v32.11,30.12 32.11,27.38 v24.33,19.61
PL1
  Top 0.152: IC1.36 34.54,28.9 34.54,29.67 33.48,30.73 30.12,30.73 18.69,19.3 18.69,14.27 13.66,9.25 13.66,7.72 11.53,5.59 11.53,4.52 12.14,3.91 13.21,3.91 13.97,4.67 13.97,5.59 14.73,6.35 16.56,6.35 17.78,5.13 J4.5
PL2  (via drill 0.3)
  Top 0.152: v35,26.92 35,28.75 IC1.37
  Bottom 0.152: v35,26.92 35,7.42 36.83,5.59 36.83,4.67 36.07,3.91 21.44,3.91 20.37,4.98 J4.6
PL3  (via drill 0.3)
  Top 0.152: v36.98,24.94 35.61,26.31 35.61,28.75 IC1.38 | v41.55,3.45 24.49,3.45 J4.7
  Bottom 0.152: v36.98,24.94 36.98,7.87 39.42,5.44 39.42,4.52 40.49,3.45 v41.55,3.45
PL4  (via drill 0.3)
  Top 0.152: v32.11,31.34 34.39,31.34 36.07,29.67 36.07,28.9 IC1.39 | J4.8 v25.4,21.44
  Bottom 0.152: v32.11,31.34 32.11,30.89 25.4,24.18 v25.4,21.44
PL5  (via drill 0.3)
  Top 0.152: v30.43,7.57 33.78,7.57 37.9,11.68 37.9,14.58 43.38,20.07 43.38,25.25 43.23,25.4 38.66,25.4 36.52,27.53 36.52,28.75 IC1.40
  Bottom 0.152: J4.9 v30.43,7.57
PL6  (via drill 0.3)
  Top 0.152: v31.8,6.35 33.02,6.35 38.2,11.53 38.2,14.43 43.69,19.91 43.69,25.4 43.38,25.7 38.81,25.7 37.13,27.38 37.13,28.75 IC1.41
  Bottom 0.152: v31.8,6.35 30.58,5.13 J4.10
PL7
  Top 0.152: J4.11 33.02,5.59 38.51,11.07 38.51,14.27 43.99,19.76 43.99,25.55 43.54,26.01 38.96,26.01 37.59,27.38 37.59,28.75 IC1.42
RST
  Bottom 0.152: J1.5 13.36,33.02 24.03,43.69 24.03,49.78 29.06,54.81 44.3,54.81 45.67,53.44 J2.1
RX0
  Top 0.152: IC1.2 27.69,42.32 28.3,42.32 29.06,43.08 29.06,46.43 32.41,49.78 32.41,50.55 33.93,52.07 41.86,52.07 43.08,53.29 J2.2
SCK  (via drill 0.3)
  Top 0.152: v25.7,33.32 27.53,33.32 IC1.20
  Bottom 0.152: v25.7,33.32 25.7,33.93 26.01,34.24 26.01,34.54 22.81,37.74 19.91,37.74 12.75,30.58 J1.3
TX0  (via drill 0.3)
  Top 0.152: v29.67,43.08 28.45,41.86 27.69,41.86 IC1.3
  Bottom 0.152: v29.67,43.08 29.67,45.67 36.83,52.83 36.83,53.75 37.59,54.51 39.57,54.51 40.64,53.44 J2.3
VCC  (via drill 0.3)
  Top 0.152: IC1.10 27.69,38.35 29.82,38.35 32.41,35.76 32.71,35.76 33.17,36.22 33.17,40.34 29.52,43.99 29.52,44.76 IC1.100 29.52,44.91 29.52,45.67 33.02,49.17 33.02,49.48 C3.2 33.17,49.63 33.78,49.63 34.85,50.7 37.13,50.7 38.2,49.63 C4.2 38.35,49.63 40.49,49.63 C5.2 40.64,49.63 v41.55,50.55 | 48.26,50.7 49.48,49.48 49.48,35 48.87,34.39 47.65,34.39 46.28,35.76 43.69,35.76 IC1.61 | 48.26,50.7 45.82,48.26 42.16,48.26 39.57,45.67 39.57,44.91 IC1.80 | 48.26,50.7 J6.2 J6.1 | R4.2 21.59,38.35 19.15,38.35 R3.2 19,38.2 v17.47,38.2 | R6.2 21.59,33.17 19.15,33.17 R5.1 19,33.32 17.47,33.32 v15.19,35.61 | 5.13,36.83 5.13,38.05 J5.14 | 5.13,36.83 5.13,35.61 J5.13 | 5.13,36.83 10.62,36.83 11.84,38.05 12.6,38.05 J3.1 | J4.1 7.72,5.13 10.16,5.13 J4.2 | v28.75,11.38 34.7,11.38 LED1.2 | v32.11,26.62 32.11,28.75 IC1.31
  Bottom 0.152: 41.55,50.85 48.26,50.85 J6.2 | 41.55,50.85 41.4,50.85 38.96,53.29 38.2,53.29 J2.4 | 41.55,50.85 v41.55,50.55 41.55,46.13 31.95,36.52 31.95,32.26 32.71,31.5 32.71,27.23 v32.11,26.62 32.11,12.75 28.45,9.09 27.38,9.09 26.77,9.7 26.77,11.38 | J3.1 15.04,35.76 | 15.04,35.76 v17.47,38.2 | 15.04,35.76 v15.19,35.61 | J5.13 5.13,35.46 6.35,34.24 6.35,32.56 10.16,28.75 J1.2 10.16,22.5 9.25,21.59 9.25,13.66 12.45,10.46 | 26.77,11.38 20.22,11.38 17.78,8.94 | 26.77,11.38 v28.75,11.38 | J4.2 10.16,6.96 11.84,8.64 11.84,9.85 12.45,10.46 | 12.45,10.46 16.26,10.46 17.78,8.94 | 17.78,8.94 IC2.8
XTAL1
  Top 0.152: IC1.34 33.63,28.75 33.63,27.53 36.98,24.18 40.18,24.18 Y1.1 40.34,24.03 40.64,23.72 40.64,20.37 C1.1
XTAL2
  Top 0.152: IC1.33 33.02,28.75 33.02,26.31 30.89,24.18 Y1.2 30.73,24.03 30.43,23.72 30.43,20.37 C2.1

### Text on the board
tPlace: GND | GND | VCC | TX0 | RX0 | RST | VCC | VCC | PA3 | PA4 | PA5 | GND | VCC | PA6 | VCC | PA7 | VCC | PG2 | PG5 | PC7 | PE3 | PC6 | PE5 | PC5 | PH3 | PH4 | PC4 | PC3 | PH5 | PC2 | PH6 | PC1 | PB4 | PB5 | PC0 | PG1 | PB6 | PG0 | GND | GND | GND | GND | VCC | VCC | PB7 | PL0 | PL1 | PL2 | PL3 | PL4 | PL5 | PL6 | PL7 | PD0 | PD1 | PD7 | GND | GND
bPlace: MegaMini_RTC revision 1.0